# EAGLE schematic freq-gen (EAGLE 8.0.2)
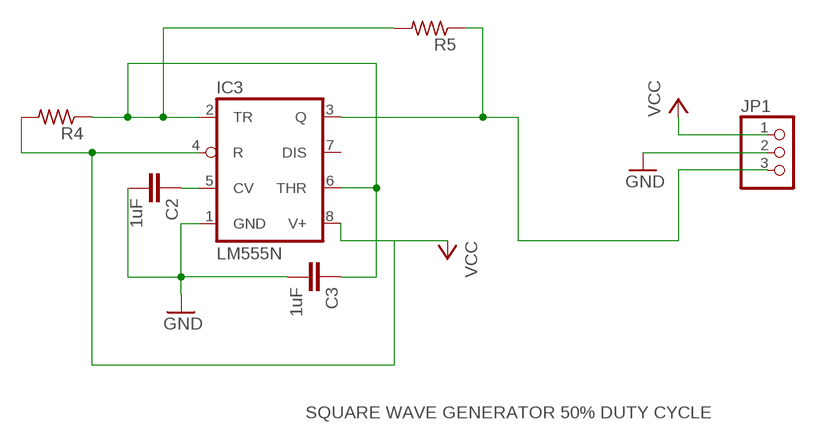
[diagram p0: schematic, sheet 1]

## Parts
C2  1uF  C2,5-3  [C2.5-3]
C3  1uF  C2,5-3  [C2.5-3]
IC3  LM555N  [DIL08-ROUND]
JP1  PINHD-1X3  [1X03]
R4  R-US_0204/7  [0204/7]
R5  R-US_0204/7  [0204/7]

## Nets
CLK: IC3.3(Q) JP1.3 R5.1
GND: C2.2 C3.2 IC3.1(GND) JP1.2
N$16: C2.1 IC3.5(CV)
N$18: C3.1 IC3.2(TR) IC3.6(THR) R4.1 R5.2
VCC: IC3.4(R) IC3.8(V+) JP1.1 R4.2
Unconnected: IC3.7(DIS)

## Notes on the sheet
- SQUARE WAVE GENERATOR 50% DUTY CYCLE

## Library data of the parts
C2 C3 = capacitor-wima:C: CAPACITOR naming: grid - package width
IC3 = adafruit:*555: TIMER Changed DIP package to have round (not oval) pin pads http://www.ladyada.net/library/pcb/eaglelibrary.html
JP1 = pinhead:PINHD-1X3: PIN HEADER
R4 R5 = adafruit:R-US_: RESISTOR, American symbol